# Altium schematic sheet W5500_SCH.SchDoc
size A4
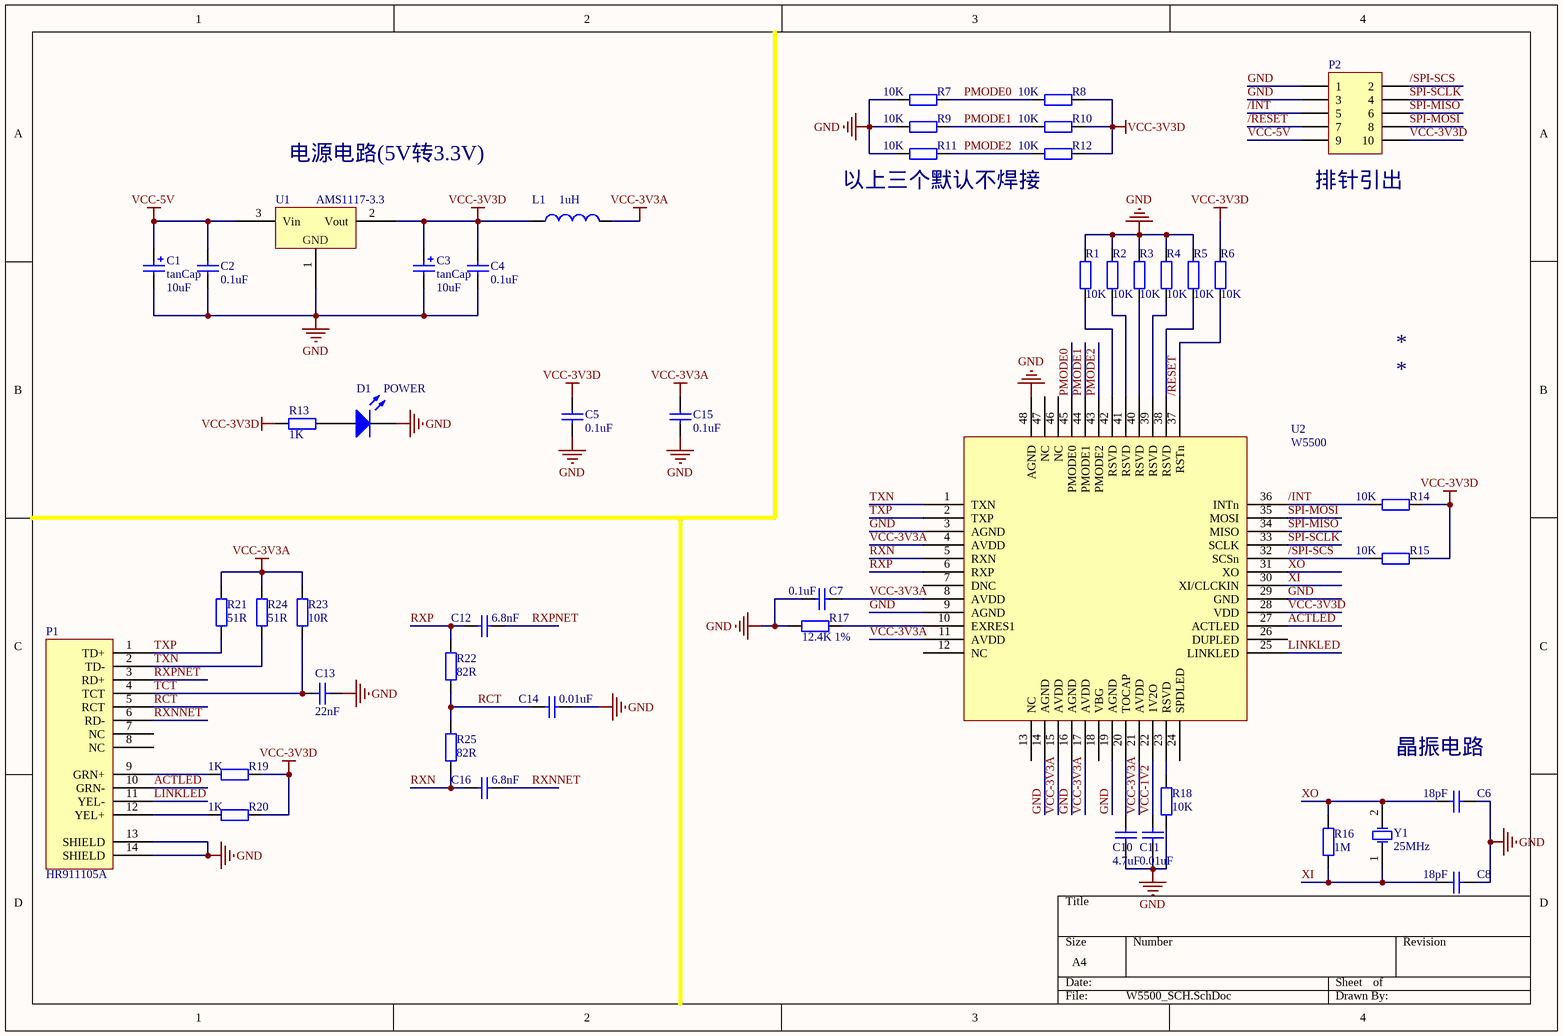
[diagram p0: W5500_SCH.SchDoc]

## Parts
C1  tanCap  value 10uF  [C1206]
C2  value 0.1uF  [C0805]  (hidden comment: Cap)
C3  tanCap  value 10uF  [C1206]
C4  value 0.1uF  [C0805]  (hidden comment: Cap)
C5  value 0.1uF  [C0805]  (hidden comment: Cap)
C6  value 18pF  [C0805]  (hidden comment: Cap)
C7  value 0.1uF  [C0805]  (hidden comment: Cap)
C8  value 18pF  [C0805]  (hidden comment: Cap)
C10  value 4.7uF  [C0805]  (hidden comment: Cap)
C11  value 0.01uF  [C0805]  (hidden comment: Cap)
C12  value 6.8nF  [C0805]  (hidden comment: Cap)
C13  value 22nF  [C0805]  (hidden comment: Cap)
C14  value 0.01uF  [C0805]  (hidden comment: Cap)
C15  value 0.1uF  [C0805]  (hidden comment: Cap)
C16  value 6.8nF  [C0805]  (hidden comment: Cap)
D1  POWER  [C0805]
L1  value 1uH  [C0805]  (hidden comment: Inductor)
P1  HR911105A  [HR911105A]
P2  排针引出  [HDR2X5]
R1  value 10K  [C0805]  (hidden comment: Res2)
R2  value 10K  [C0805]  (hidden comment: Res2)
R3  value 10K  [C0805]  (hidden comment: Res2)
R4  value 10K  [C0805]  (hidden comment: Res2)
R5  value 10K  [C0805]  (hidden comment: Res2)
R6  value 10K  [C0805]  (hidden comment: Res2)
R7  value 10K  [C0805]  (hidden comment: Res2)
R8  value 10K  [C0805]  (hidden comment: Res2)
R9  value 10K  [C0805]  (hidden comment: Res2)
R10  value 10K  [C0805]  (hidden comment: Res2)
R11  value 10K  [C0805]  (hidden comment: Res2)
R12  value 10K  [C0805]  (hidden comment: Res2)
R13  value 1K  [C0805]  (hidden comment: Res2)
R14  value 10K  [C0805]  (hidden comment: Res2)
R15  value 10K  [C0805]  (hidden comment: Res2)
R16  value 1M  [C0805]  (hidden comment: Res2)
R17  value 12.4K 1%  [C0805]  (hidden comment: Res2)
R18  value 10K  [C0805]  (hidden comment: Res2)
R19  value 1K  [C0805]  (hidden comment: Res2)
R20  value 1K  [C0805]  (hidden comment: Res2)
R21  value 51R  [C0805]  (hidden comment: Res2)
R22  value 82R  [C0805]  (hidden comment: Res2)
R23  value 10R  [C0805]  (hidden comment: Res2)
R24  value 51R  [C0805]  (hidden comment: Res2)
R25  value 82R  [C0805]  (hidden comment: Res2)
U1  AMS1117-3.3  [SOT223_M]
U2  W5500  [LQFP48]
Y1  25MHz  [XTAL-HC49]

## Nets
GND: C1.2 C2.2 C3.2 C4.2 C5.2 C6.1 C7.2 C8.1 C10.2 C11.2 C13.2 C14.1 C15.1 D1.2(K) P1.13(SHIELD) P1.14(SHIELD) P2.1 P2.3 R1.2 R2.2 R3.2 R4.2 R5.2 R7.1 R9.1 R11.1 R17.1 R18.1 U1.1(GND) U2.3(AGND) U2.9(AGND) U2.14(AGND) U2.16(AGND) U2.19(AGND) U2.29(GND) U2.48(AGND)
VCC-3V3A: C7.1 C15.2 L1.2 R21.1 R23.1 R24.1 U2.4(AVDD) U2.8(AVDD) U2.11(AVDD) U2.15(AVDD) U2.17(AVDD) U2.21(AVDD)
VCC-3V3D: C3.1 C4.1 C5.1 L1.1 P2.10 R6.2 R8.2 R10.2 R12.2 R13.2 R14.2 R15.2 R19.1 R20.1 U1.2(Vout) U2.28(VDD)
VCC-5V: C1.1 C2.1 P2.9 U1.3(Vin)
/INT: P2.5 R14.1 U2.36(INTn)
/RESET: P2.7 R6.1 U2.37(RSTn)
/SPI-SCS: P2.2 R15.1 U2.32(SCSn)
ACTLED: P1.10(GRN-) U2.27(ACTLED)
LINKLED: P1.11(YEL-) U2.25(LINKLED)
PMODE0: R7.2 R8.1 U2.45(PMODE0)
PMODE1: R9.2 R10.1 U2.44(PMODE1)
PMODE2: R11.2 R12.1 U2.43(PMODE2)
RCT: C14.2 P1.5(RCT) R22.1 R25.2
RXN: C16.2 R25.1 U2.5(RXN)
RXNNET: C16.1 P1.6(RD-)
RXP: C12.2 R22.2 U2.6(RXP)
RXPNET: C12.1 P1.3(RD+)
SPI-MISO: P2.6 U2.34(MISO)
SPI-MOSI: P2.8 U2.35(MOSI)
SPI-SCLK: P2.4 U2.33(SCLK)
TCT: C13.1 P1.4(TCT) R23.2
TXN: P1.2(TD-) R24.2 U2.1(TXN)
TXP: P1.1(TD+) R21.2 U2.2(TXP)
VCC-1V2: C11.1 U2.22(1V2O)
XI: C8.2 R16.1 U2.30(XI/CLCKIN) Y1.1(OSC1)
XO: C6.2 R16.2 U2.31(XO) Y1.2(OSC2)
NetC10_1: C10.1 U2.20(TOCAP)
NetD1_1: D1.1(A) R13.1
NetP1_9: P1.9(GRN+) R19.2
NetP1_12: P1.12(YEL+) R20.2
NetR1_1: R1.1 U2.42(RSVD)
NetR2_1: R2.1 U2.41(RSVD)
NetR3_1: R3.1 U2.40(RSVD)
NetR4_1: R4.1 U2.39(RSVD)
NetR5_1: R5.1 U2.38(RSVD)
NetR17_2: R17.2 U2.10(EXRES1)
NetR18_2: R18.2 U2.23(RSVD)

Not connected (* = marked no-connect by the designer): P1 7(NC) 8(NC); U2 7(DNC) 12(NC) 13(NC) 18(VBG) 24(SPDLED) 26(DUPLED) 46(NC) 47(NC)

## Notes on the sheet
- 电源电路(5V转3.3V)
- (near R11) 以上三个默认不焊接
- (near C6) 晶振电路

## Library data of the parts
C1 C3 = Cap Pol2: Polarized Capacitor (Axial); Published: 8-Jun-2000; LatestRevisionDate: 17-Jul-2002; LatestRevisionNote: Re-released for DXP Platform.; PackageReference: POLAR0.8; Publisher: Altium Limited; PackageDescription: Polarized Capacitor; 2 Leads
C2 C4-C8 C10-C16 = Cap: Capacitor; Published: 8-Jun-2000; LatestRevisionDate: 17-Jul-2002; LatestRevisionNote: Re-released for DXP Platform.; PackageReference: RAD-0.3; Publisher: Altium Limited; PackageDescription: Radial Cap, Thru-Hole; 2 Leads; 0.3 in Pin Spacing
D1 = LED0: Typical INFRARED GaAs LED; Published: 8-Jun-2000; LatestRevisionDate: 08-Jul-2005; LatestRevisionNote: Mech Layer 1 removed.; PackageReference: LED-0; Publisher: Altium Limited; PackageDescription: LED; 2 Leads
L1 = Inductor: Code_IEC: 1005; Published: 8-Jun-2000; LatestRevisionDate: 29-May-2009; LatestRevisionNote: IPC-7351 Footprint Added.; PackageReference: 0402-A; Publisher: Altium Limited; PackageDescription: Chip Inductor; Code_JEITA: 0402
P1 = HR911105A: RJ45插座
P2 = Header 5X2: Header, 5-Pin, Dual row; LatestRevisionDate: 17-Jul-2002; LatestRevisionNote: Re-released for DXP Platform.; Publisher: Altium Limited
R1-R25 = Res2: Resistor; Published: 8-Jun-2000; LatestRevisionDate: 17-Jul-2002; LatestRevisionNote: Re-released for DXP Platform.; PackageReference: AXIAL-0.4; Publisher: Altium Limited; PackageDescription: Axial Device, Thru-Hole; 2 Leads; 0.4 in Pin Spacing
U1 = AMS1117: AMS1117-
U2 = W5500: W5500以太网芯片
Y1 = XTAL: Crystal Oscillator; Published: 8-Jun-2000; LatestRevisionDate: 17-Jul-2002; LatestRevisionNote: Re-released for DXP Platform.; PackageReference: R38; Publisher: Altium Limited; PackageDescription: Crystal, Thru-Hole; 2 Leads; Body 3.1 x 8.2 mm (Dia.xH)